# Altium schematic sheet MONO_DEV.SchDoc
size A; SheetNumber: 1; SheetTotal: 1
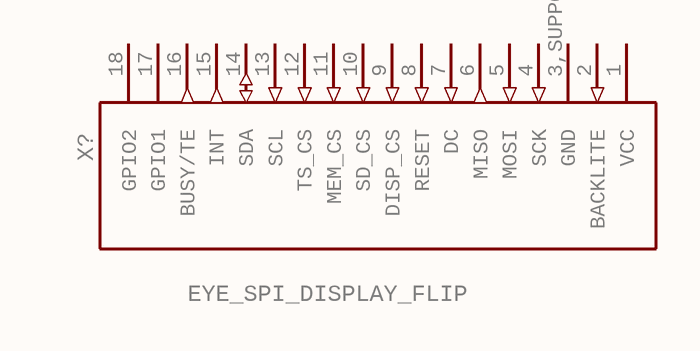
[diagram p0: MONO_DEV.SchDoc]

## Parts
X?  EYE_SPI_DISPLAY_FLIP  [EYE_SPI_DISPLAY_BOTCONTACT]

## Nets

Not connected (* = marked no-connect by the designer): X? 1(VCC) 2(BACKLITE) 3,SUPPORT1,SUPPORT2(GND) 4(SCK) 5(MOSI) 6(MISO) 7(DC) 8(RESET) 9(DISP_CS) 10(SD_CS) 11(MEM_CS) 12(TS_CS) 13(SCL) 14(SDA) 15(INT) 16(BUSY/TE) 17(GPIO1) 18(GPIO2)

## Library data of the parts
X? = EYE_SPI_DISPLAY_FLIP: GateName_1: G$1; DeviceName: _FLIP; SymbolName_1: EYE_SPI_DISPLAY; LibraryName: adafruit_display; DeviceSetName: EYE_SPI_DISPLAY; LCSC: C2856802